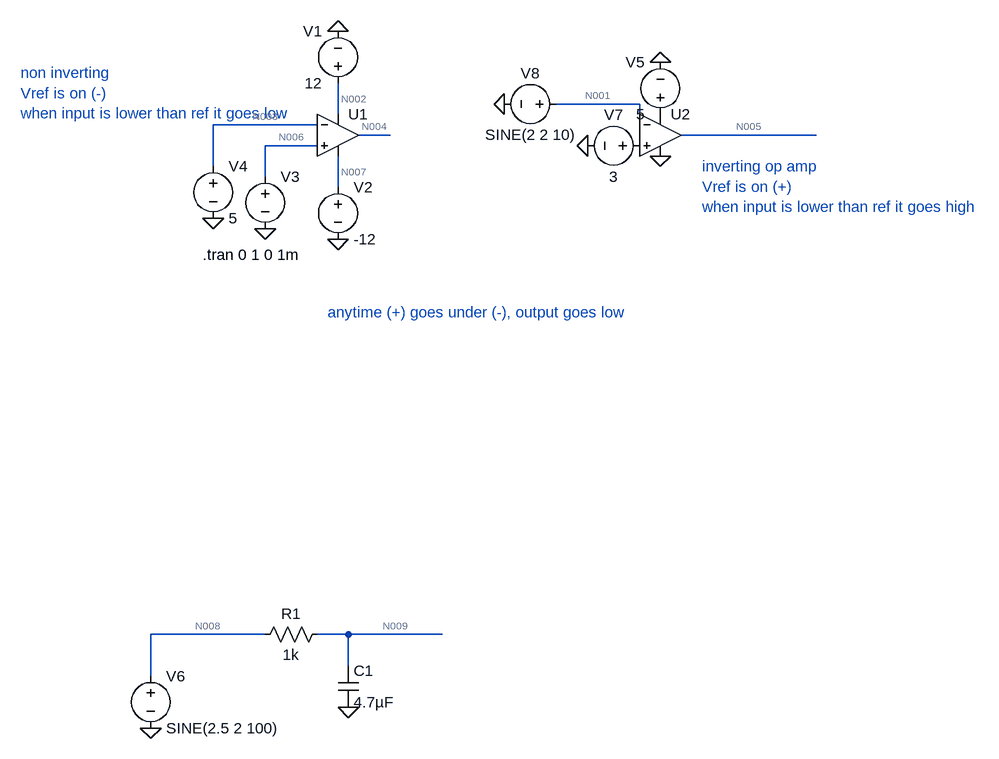
[diagram p0: schematic invertingnoninverting.asc]
invertingnoninverting.asc, the LTspice schematic file:
Version 4.1
SHEET 1 1208 1108
WIRE 640 128 512 128
WIRE 176 144 176 96
WIRE 144 160 -16 160
WIRE 640 160 640 128
WIRE 256 176 208 176
WIRE 912 176 704 176
WIRE 144 192 64 192
WIRE -16 224 -16 160
WIRE 64 240 64 192
WIRE 176 256 176 208
WIRE 64 944 -112 944
WIRE 192 944 144 944
WIRE 336 944 192 944
WIRE 192 992 192 944
WIRE -112 1008 -112 944
FLAG 176 16 0
FLAG 176 336 0
FLAG 64 320 0
FLAG -16 304 0
FLAG 672 64 0
FLAG 560 192 0
FLAG 432 128 0
FLAG 672 208 0
FLAG -112 1088 0
FLAG 192 1056 0
SYMBOL OpAmps\\UniversalOpAmp2 176 176 R0
SYMATTR InstName U1
SYMBOL voltage 176 112 R180
WINDOW 0 24 96 Left 2
WINDOW 3 24 16 Left 2
WINDOW 123 0 0 Left 0
WINDOW 39 0 0 Left 0
SYMATTR InstName V1
SYMATTR Value 12
SYMBOL voltage 176 240 R0
WINDOW 123 0 0 Left 0
WINDOW 39 0 0 Left 0
SYMATTR InstName V2
SYMATTR Value -12
SYMBOL voltage 64 224 R0
WINDOW 3 24 96 Invisible 2
WINDOW 123 0 0 Left 0
WINDOW 39 0 0 Left 0
SYMATTR Value SINE(0 6 10)
SYMATTR InstName V3
SYMBOL voltage -16 208 R0
WINDOW 123 0 0 Left 0
WINDOW 39 0 0 Left 0
SYMATTR InstName V4
SYMATTR Value 5
SYMBOL OpAmps\\UniversalOpAmp2 672 176 R0
SYMATTR InstName U2
SYMBOL voltage 672 160 R180
WINDOW 0 24 96 Left 2
WINDOW 3 24 16 Left 2
WINDOW 123 0 0 Left 0
WINDOW 39 0 0 Left 0
SYMATTR InstName V5
SYMATTR Value 5
SYMBOL voltage 656 192 R90
WINDOW 0 -32 56 VBottom 2
WINDOW 3 32 56 VTop 2
WINDOW 123 0 0 Left 0
WINDOW 39 0 0 Left 0
SYMATTR InstName V7
SYMATTR Value 3
SYMBOL voltage 528 128 R90
WINDOW 0 -32 56 VBottom 2
WINDOW 3 32 56 VTop 2
WINDOW 123 0 0 Left 0
WINDOW 39 0 0 Left 0
SYMATTR InstName V8
SYMATTR Value SINE(2 2 10)
SYMBOL voltage -112 992 R0
WINDOW 123 0 0 Left 0
WINDOW 39 0 0 Left 0
SYMATTR InstName V6
SYMATTR Value SINE(2.5 2 100)
SYMBOL res 160 928 R90
WINDOW 0 0 56 VBottom 2
WINDOW 3 32 56 VTop 2
SYMATTR InstName R1
SYMATTR Value 1k
SYMBOL cap 176 992 R0
SYMATTR InstName C1
SYMATTR Value 4.7µF
TEXT -32 360 Left 2 !.tran 0 1 0 1m
TEXT 736 224 Left 2 ;inverting op amp \nVref is on (+)\nwhen input is lower than ref it goes high
TEXT -312 80 Left 2 ;non inverting\nVref is on (-)\nwhen input is lower than ref it goes low
TEXT 160 448 Left 2 ;anytime (+) goes under (-), output goes low

The netlist it stands for:
* invertingnoninverting.asc
X§U1 N006 N003 N002 N007 N004 level2 Avol=1Meg GBW=10Meg Slew=10Meg Ilimit=25m Rail=0 Vos=0 En=0 Enk=0 In=0 Ink=0 Rin=500Meg  ; pins In+ In- V+ V- OUT
V1 N002 0 12
V2 N007 0 -12
V3 N006 0 SINE(0 6 10)
V4 N003 0 5
X§U2 P001 N001 P002 0 N005 level2 Avol=1Meg GBW=10Meg Slew=10Meg Ilimit=25m Rail=0 Vos=0 En=0 Enk=0 In=0 Ink=0 Rin=500Meg  ; pins In+ In- V+ V- OUT
V5 P002 0 5
V7 P001 0 3
V8 N001 0 SINE(2 2 10)
V6 N008 0 SINE(2.5 2 100)
R1 N009 N008 1k
C1 N009 0 4.7µF
.tran 0 1 0 1m
* inverting op amp
* Vref is on (+)
* when input is lower than ref it goes high
* non inverting
* Vref is on (-)
* when input is lower than ref it goes low
* anytime (+) goes under (-), output goes low
.lib UniversalOpAmp2.lib
.backanno
.end

* Results of the author's LTspice run, read from the files saved beside the schematic
* Operating Point, zero values left out:
*   V(n001) = 2 V
*   V(n002) = 12 V
*   V(n003) = 5 V
*   V(n004) = -12 V
*   V(n005) = 5 V
*   V(n007) = -12 V
*   V(n008) = 2.5 V
*   V(n009) = 2.5 V
*   V(p001) = 3 V
*   V(p002) = 5 V
*   I(V1) = -2.687 µA
*   I(V2) = 2.452 µA
*   I(V4) = -10 nA
*   I(V5) = -460.2 nA
*   I(V7) = -1 nA
*   I(V8) = 1 nA
*   Ix(u1:2) = 10 nA
*   Ix(u1:3) = 2.687 µA
*   Ix(u1:4) = -2.452 µA
*   Ix(u2:1) = 1 nA
*   Ix(u2:2) = -1 nA
*   Ix(u2:3) = 460.2 nA
*   Ix(u2:4) = -610.5 nA
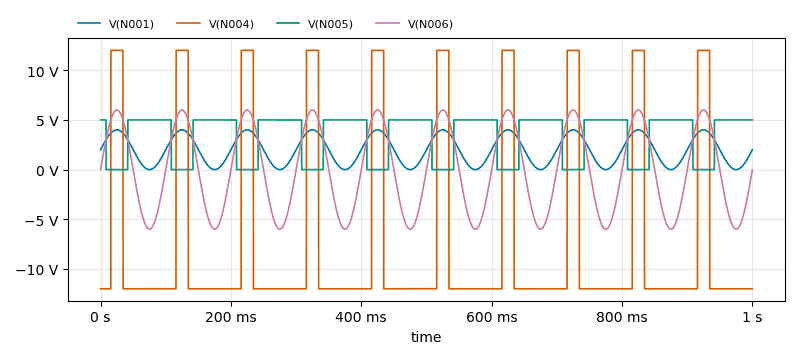
[diagram p1: Transient Analysis of invertingnoninverting.asc, plotted from the saved traces]
* Transient Analysis, 1 run:
*   V(N001): min 25.34 µV, max 4 V, average 2 V, rms 2.45 V, last 2 V
*   V(N004): min -12 V, max 12 V, average -7.526 V, rms 12 V, last -12 V
*   V(N005): min 4.583 µV, max 5 V, average 3.335 V, rms 4.083 V, last 5 V
*   V(N006): min -6 V, max 6 V, average 56.5 µV, rms 4.243 V, last 0 V